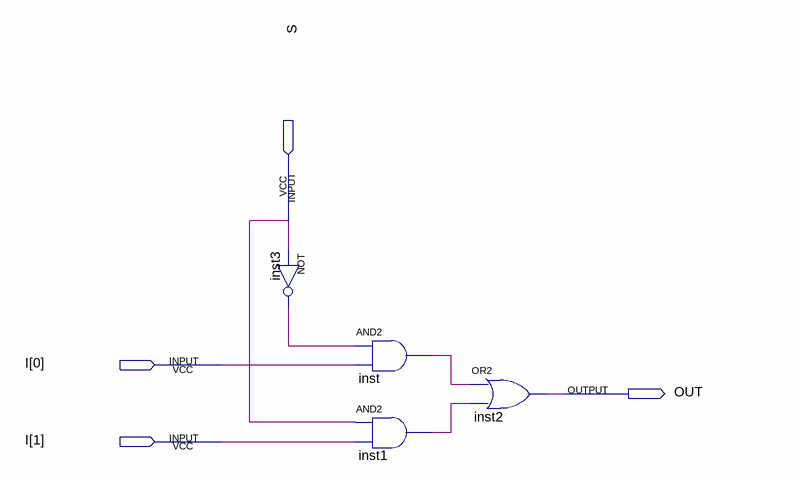
[diagram p0: schematic sheet]
// Quartus schematic mux21bit.bdf as structural Verilog: 4 symbols, 4 pins
module mux21bit (
  input  S,
  input  [1:0] I,
  output OUT
);

  wire inst1_out, inst3_out, inst_out;

  not inst3 (inst3_out, S);
  and inst (inst_out, inst3_out, I[0]);
  and inst1 (inst1_out, S, I[1]);
  or inst2 (OUT, inst_out, inst1_out);
endmodule
